# Altium schematic sheet PAGE1.SCHDOC: Active Tag 916 Transmitter/Processor
size B; DocumentNumber: Credit Card Size Tag; Revision: 37; SheetNumber: 1; SheetTotal: 2
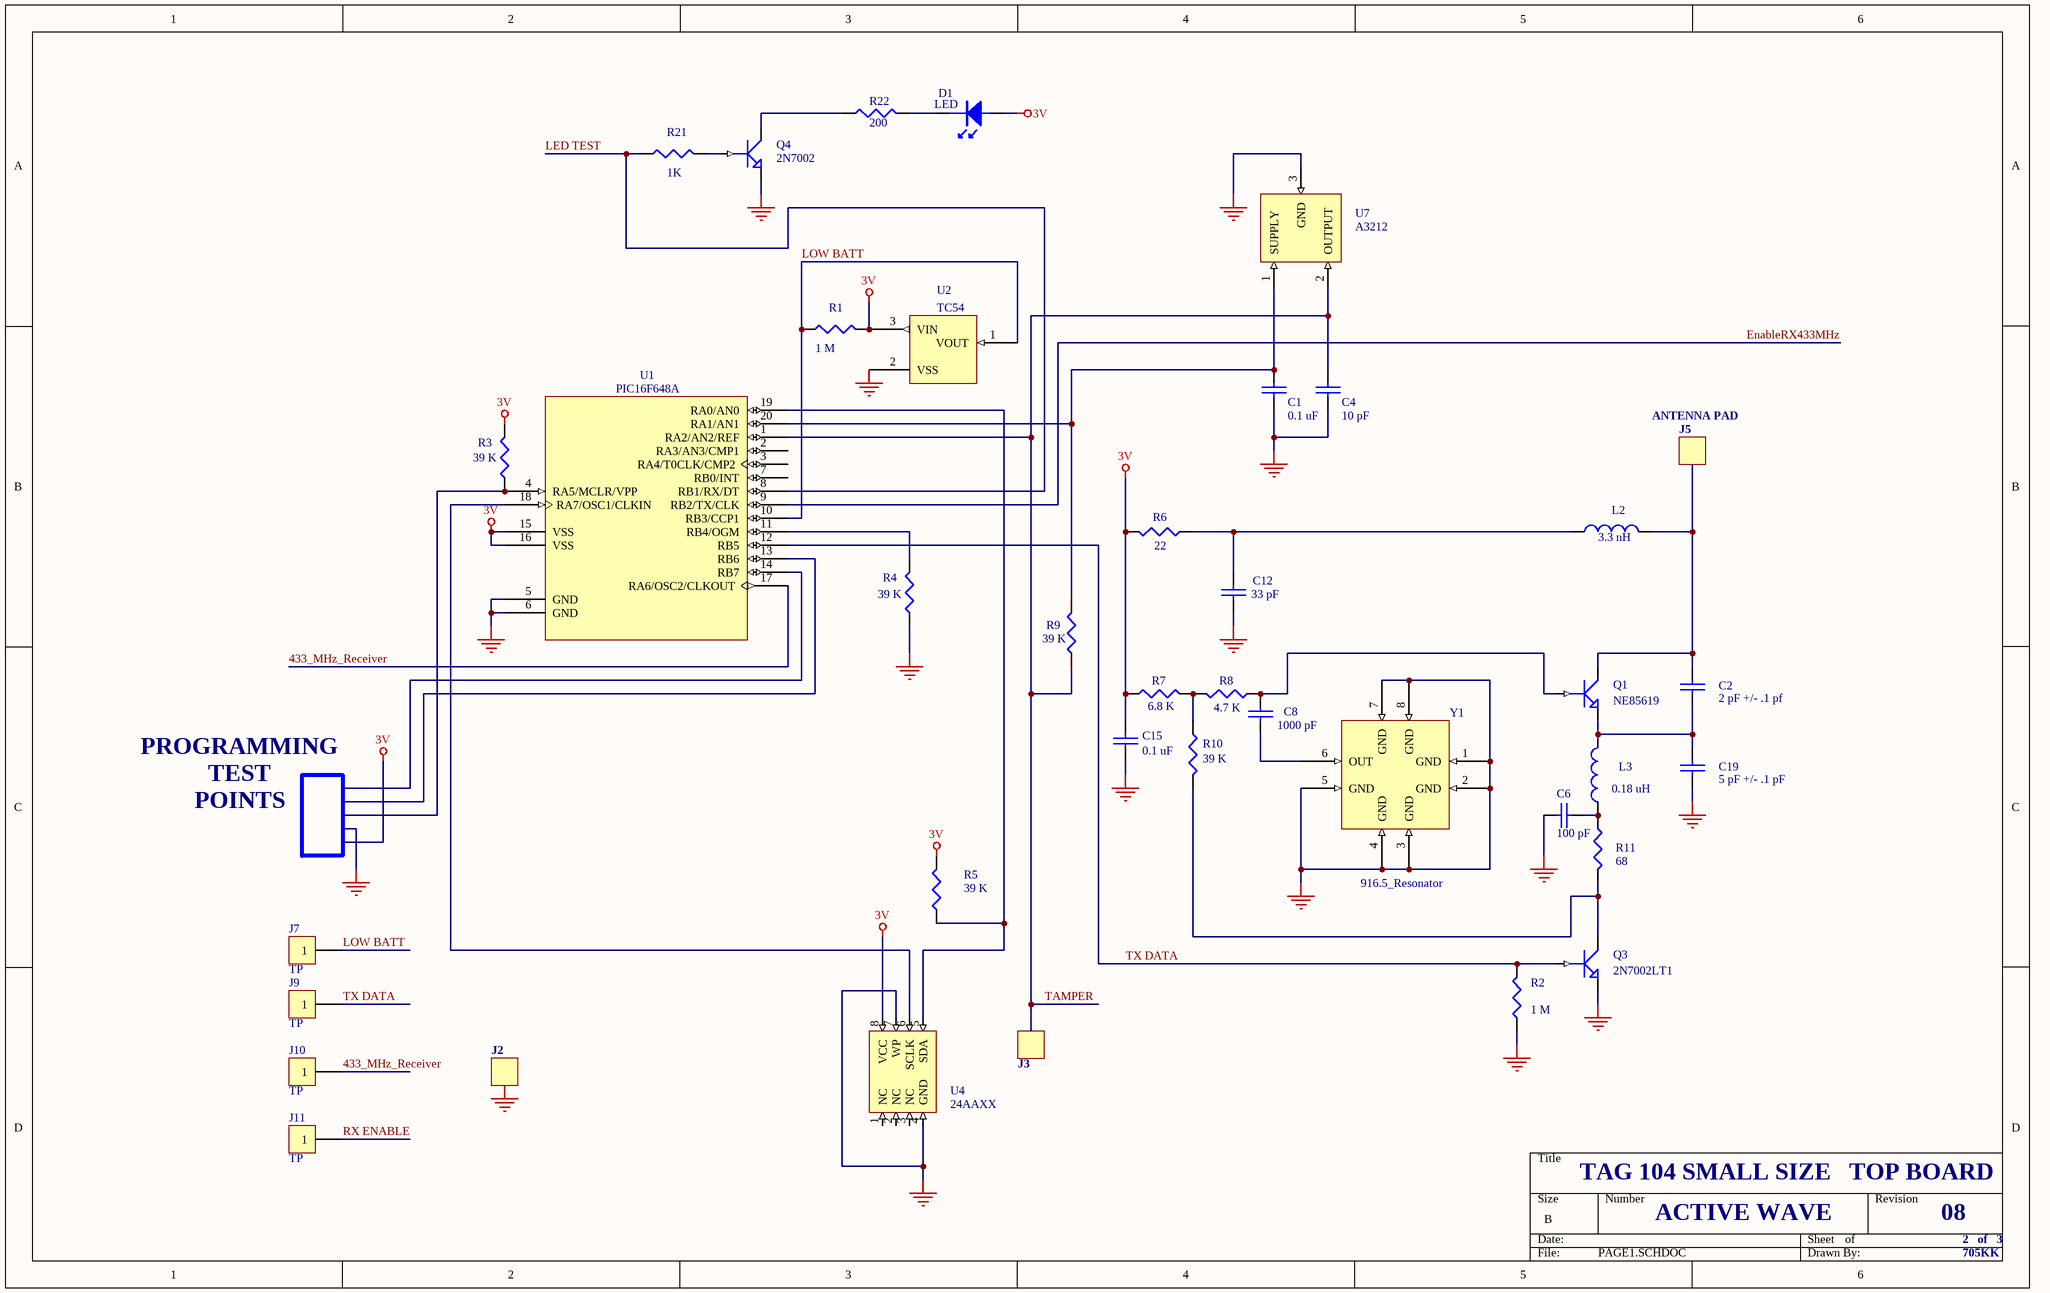
[diagram p0: PAGE1.SCHDOC]

## Parts
C1  0.1 uF  [0603]
C2  2 pF +/- .1 pf  [0603]
C4  10 pF  [0603]
C6  100 pF  [0603]
C8  1000 pF  [0603]
C12  33 pF  [0603]
C15  0.1 uF  [0603]
C19  5 pF +/- .1 pF  [0603]
D1  LED  [LED STANLEY H_1105W]
J7  TP  [TEST POINT PAD 5]
J9  TP  [TEST POINT PAD 5]
J10  TP  [TEST POINT PAD 5]
J11  TP  [TEST POINT PAD 5]
L2  3.3 nH  [0603]
L3  0.18 uH  [0603]
Q1  NE85619  [3 PIN ULTRA SUPER MINI MOLD]
Q3  2N7002LT1  [SOT23 TRANS]
Q4  2N7002  [SOT23 TRANS]
R1  1 M  [0603]
R2  1 M  [0603]
R3  39 K  [0603]
R4  39 K  [0603]
R5  39 K  [0603]
R6  22  [0603]
R7  6.8 K  [0603]
R8  4.7 K  [0603]
R9  39 K  [0603]
R10  39 K  [0603]
R11  68  [0603]
R21  1K  [0603]
R22  200  [0603]
U1  PIC16F648A  [SSOP20 WIDE]
U2  TC54  [SOT23]
U4  24AAXX  [SO8]
U7  A3212  [SOT23W]
Y1  916.5_Resonator  [RESONATOR]

## Nets
3V: C15.1 D1.A R1.2 R3.2 R5.2 R6.2 R7.1 U1.15(VSS) U1.16(VSS) U2.3(VIN) U4.8(VCC)
GND_SIGNAL: C1.2 C4.2 C6.1 C12.2 C15.2 C19.2 Q3.E Q4.E R2.1 R4.1 U1.5(GND) U1.6(GND) U2.2(VSS) U4.4(GND) U4.7(WP) U7.3(GND) Y1.1(GND) Y1.2(GND) Y1.3(GND) Y1.4(GND) Y1.5(GND) Y1.7(GND) Y1.8(GND)
433_MHz_Receiver: J10.1 U1.17(RA6/OSC2/CLKOUT)
EnableRX433MHz: U1.9(RB2/TX/CLK)
LED TEST: R21.1 U1.8(RB1/RX/DT)
LOW BATT: J7.1 R1.1 U1.10(RB3/CCP1) U2.1(VOUT)
RX ENABLE: J11.1
TAMPER: C4.1 R9.1 U1.1(RA2/AN2/REF) U7.2(OUTPUT)
TX DATA: J9.1 Q3.B R2.2 U1.12(RB5)
NetC1_1: C1.1 R9.2 U1.20(RA1/AN1) U7.1(SUPPLY)
NetC2_1: C2.1 L2.2 Q1.C
NetC2_2: C2.2 C19.1 L3.2 Q1.E
NetC6_2: C6.2 L3.1 R11.1
NetC8_1: C8.1 Q1.B R8.1
NetC8_2: C8.2 Y1.6(OUT)
NetC12_1: C12.1 L2.1 R6.1
NetD1_K: D1.K R22.2
NetQ3_C: Q3.C R10.2 R11.2
NetQ4_B: Q4.B R21.2
NetQ4_C: Q4.C R22.1
NetR3_1: R3.1 U1.4(RA5/MCLR/VPP)
NetR4_2: R4.2 U1.11(RB4/OGM)
NetR5_1: R5.1 U1.19(RA0/AN0) U4.5(SDA)
NetR7_2: R7.2 R8.2 R10.1
NetU1_18: U1.18(RA7/OSC1/CLKIN) U4.6(SCLK)

Not connected (* = marked no-connect by the designer): U1 2(RA3/AN3/CMP1) 3(RA4/T0CLK/CMP2) 7(RB0/INT) 13(RB6) 14(RB7); U4 1(NC) 2(NC) 3(NC)

## Notes on the sheet
- ANTENNA PAD
- J5
- PROGRAMMING
- POINTS
- TEST
- J2
- J3
- TAG 104 SMALL SIZE   TOP BOARD
- ACTIVE WAVE
- 08
- 2   of   3
- 705KK
- Labels drawn without touching a wire or pin: GND_SIGNAL

## Library data of the parts
C1 C2 C4 C6 C8 C12 C15 C19 = CAP: Capacitor
J7 J9-J11 = CON1: Connector
L2 L3 = INDUCTOR: Text Field1: 20; Text Field2: 40
Q1 Q3 Q4 = NPN1: NPN Transistor
R1-R10 R21 = RESISTOR: Text Field1: 20; Text Field2: 30
R11 R22 = RES1
U1 = PIC16F68A/SSOP: Text Field1: 150; Text Field2: 180
U2 = TC54_1: Text Field1: 50; Text Field2: 50
U4 = 24AA256
U7 = HALL EFFECT SWITCH
Y1 = RESONATOR